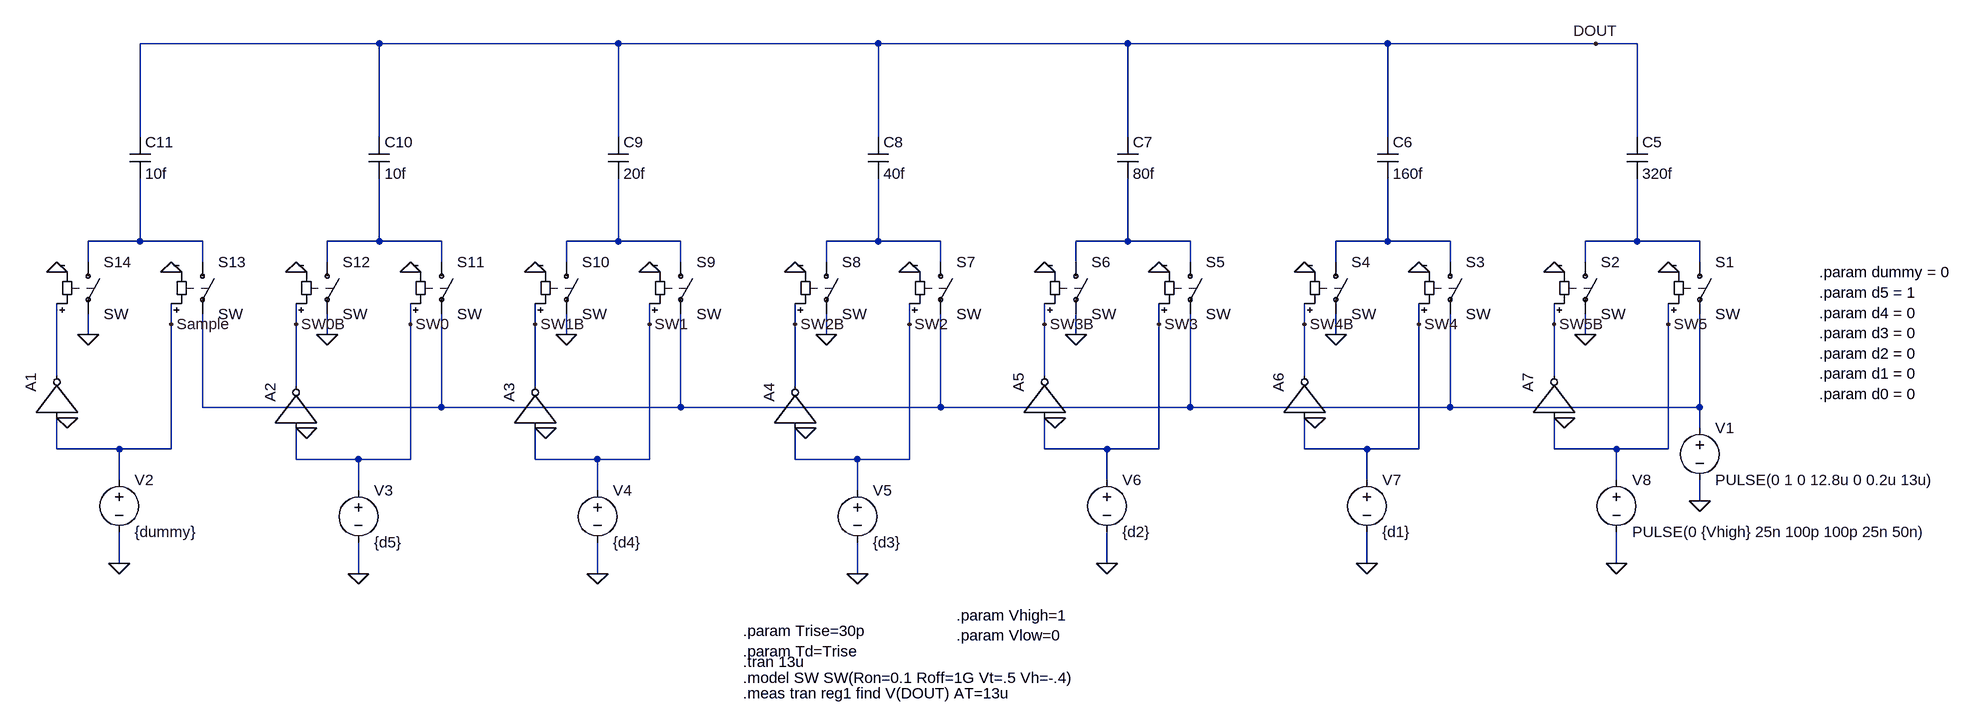
[diagram p0: schematic Draft8.asc]
Draft8.asc, the LTspice schematic file:
Version 4
SHEET 1 2616 1568
WIRE 240 384 -128 384
WIRE 608 384 240 384
WIRE 1008 384 608 384
WIRE 1392 384 1008 384
WIRE 1792 384 1392 384
WIRE 2112 384 1792 384
WIRE 2176 384 2112 384
WIRE -128 528 -128 384
WIRE 240 528 240 384
WIRE 608 528 608 384
WIRE 1008 528 1008 384
WIRE 1392 528 1392 384
WIRE 1792 528 1792 384
WIRE 2176 528 2176 384
WIRE -128 688 -128 592
WIRE -128 688 -208 688
WIRE -32 688 -128 688
WIRE 240 688 240 592
WIRE 240 688 160 688
WIRE 336 688 240 688
WIRE 608 688 608 592
WIRE 608 688 528 688
WIRE 704 688 608 688
WIRE 1008 688 1008 592
WIRE 1008 688 928 688
WIRE 1104 688 1008 688
WIRE 1392 688 1392 592
WIRE 1392 688 1312 688
WIRE 1488 688 1392 688
WIRE 1792 688 1792 592
WIRE 1792 688 1712 688
WIRE 1888 688 1792 688
WIRE 2176 688 2176 592
WIRE 2176 688 2096 688
WIRE 2272 688 2176 688
WIRE -208 720 -208 688
WIRE -32 720 -32 688
WIRE 160 720 160 688
WIRE 336 720 336 688
WIRE 528 720 528 688
WIRE 704 720 704 688
WIRE 928 720 928 688
WIRE 1104 720 1104 688
WIRE 1312 720 1312 688
WIRE 1488 720 1488 688
WIRE 1712 720 1712 688
WIRE 1888 720 1888 688
WIRE 2096 720 2096 688
WIRE 2272 720 2272 688
WIRE -80 816 -80 784
WIRE 112 816 112 784
WIRE 288 816 288 784
WIRE 480 816 480 784
WIRE 656 816 656 784
WIRE 880 816 880 784
WIRE 1056 816 1056 784
WIRE 1264 816 1264 784
WIRE 1440 816 1440 784
WIRE 1664 816 1664 784
WIRE 1840 816 1840 784
WIRE 2048 816 2048 784
WIRE 2224 816 2224 784
WIRE -208 832 -208 800
WIRE 160 832 160 800
WIRE 528 832 528 800
WIRE 928 832 928 800
WIRE 1312 832 1312 800
WIRE 1712 832 1712 800
WIRE 2096 832 2096 800
WIRE -256 896 -256 784
WIRE 1264 896 1264 816
WIRE 1664 896 1664 816
WIRE 2048 896 2048 816
WIRE 112 912 112 816
WIRE 480 912 480 816
WIRE 880 912 880 816
WIRE -32 944 -32 800
WIRE 336 944 336 800
WIRE 336 944 -32 944
WIRE 704 944 704 800
WIRE 704 944 336 944
WIRE 1104 944 1104 800
WIRE 1104 944 704 944
WIRE 1488 944 1488 800
WIRE 1488 944 1104 944
WIRE 1888 944 1888 800
WIRE 1888 944 1488 944
WIRE 2272 944 2272 800
WIRE 2272 944 1888 944
WIRE 2272 976 2272 944
WIRE -256 1008 -256 960
WIRE -160 1008 -256 1008
WIRE -80 1008 -80 816
WIRE -80 1008 -160 1008
WIRE 1264 1008 1264 960
WIRE 1360 1008 1264 1008
WIRE 1440 1008 1440 816
WIRE 1440 1008 1360 1008
WIRE 1664 1008 1664 960
WIRE 1760 1008 1664 1008
WIRE 1840 1008 1840 816
WIRE 1840 1008 1760 1008
WIRE 2048 1008 2048 960
WIRE 2144 1008 2048 1008
WIRE 2224 1008 2224 816
WIRE 2224 1008 2144 1008
WIRE 112 1024 112 976
WIRE 208 1024 112 1024
WIRE 288 1024 288 816
WIRE 288 1024 208 1024
WIRE 480 1024 480 976
WIRE 576 1024 480 1024
WIRE 656 1024 656 816
WIRE 656 1024 576 1024
WIRE 880 1024 880 976
WIRE 976 1024 880 1024
WIRE 1056 1024 1056 816
WIRE 1056 1024 976 1024
WIRE -160 1056 -160 1008
WIRE 1360 1056 1360 1008
WIRE 1760 1056 1760 1008
WIRE 2144 1056 2144 1008
WIRE 208 1072 208 1024
WIRE 576 1072 576 1024
WIRE 976 1072 976 1024
WIRE 2272 1088 2272 1056
WIRE -160 1184 -160 1136
WIRE 1360 1184 1360 1136
WIRE 1760 1184 1760 1136
WIRE 2144 1184 2144 1136
WIRE 208 1200 208 1152
WIRE 576 1200 576 1152
WIRE 976 1200 976 1152
FLAG 2096 832 0
FLAG 2224 736 0
FLAG 2048 736 0
FLAG 2224 816 SW5
FLAG 2048 816 SW5B
FLAG 1712 832 0
FLAG 1840 736 0
FLAG 1664 736 0
FLAG 1840 816 SW4
FLAG 1664 816 SW4B
FLAG 1312 832 0
FLAG 1440 736 0
FLAG 1264 736 0
FLAG 1440 816 SW3
FLAG 1264 816 SW3B
FLAG 928 832 0
FLAG 1056 736 0
FLAG 880 736 0
FLAG 1056 816 SW2
FLAG 880 816 SW2B
FLAG 528 832 0
FLAG 656 736 0
FLAG 480 736 0
FLAG 656 816 SW1
FLAG 480 816 SW1B
FLAG 160 832 0
FLAG 288 736 0
FLAG 112 736 0
FLAG 288 816 SW0
FLAG 112 816 SW0B
FLAG -208 832 0
FLAG -80 736 0
FLAG -256 736 0
FLAG -80 816 Sample
FLAG 2272 1088 0
FLAG -240 960 0
FLAG -160 1184 0
FLAG 128 976 0
FLAG 208 1200 0
FLAG 496 976 0
FLAG 576 1200 0
FLAG 896 976 0
FLAG 976 1200 0
FLAG 1280 960 0
FLAG 1360 1184 0
FLAG 1680 960 0
FLAG 1760 1184 0
FLAG 2064 960 0
FLAG 2144 1184 0
FLAG 2112 384 DOUT
SYMBOL cap 2160 528 R0
SYMATTR InstName C5
SYMATTR Value 320f
SYMBOL sw 2272 704 R0
SYMATTR InstName S1
SYMBOL sw 2096 704 R0
SYMATTR InstName S2
SYMBOL cap 1776 528 R0
SYMATTR InstName C6
SYMATTR Value 160f
SYMBOL sw 1888 704 R0
SYMATTR InstName S3
SYMBOL sw 1712 704 R0
SYMATTR InstName S4
SYMBOL cap 1376 528 R0
SYMATTR InstName C7
SYMATTR Value 80f
SYMBOL sw 1488 704 R0
SYMATTR InstName S5
SYMBOL sw 1312 704 R0
SYMATTR InstName S6
SYMBOL cap 992 528 R0
SYMATTR InstName C8
SYMATTR Value 40f
SYMBOL sw 1104 704 R0
SYMATTR InstName S7
SYMBOL sw 928 704 R0
SYMATTR InstName S8
SYMBOL cap 592 528 R0
SYMATTR InstName C9
SYMATTR Value 20f
SYMBOL sw 704 704 R0
SYMATTR InstName S9
SYMBOL sw 528 704 R0
SYMATTR InstName S10
SYMBOL cap 224 528 R0
SYMATTR InstName C10
SYMATTR Value 10f
SYMBOL sw 336 704 R0
SYMATTR InstName S11
SYMBOL sw 160 704 R0
SYMATTR InstName S12
SYMBOL cap -144 528 R0
SYMATTR InstName C11
SYMATTR Value 10f
SYMBOL sw -32 704 R0
SYMATTR InstName S13
SYMBOL sw -208 704 R0
SYMATTR InstName S14
SYMBOL voltage 2272 960 R0
WINDOW 123 0 0 Left 0
WINDOW 39 0 0 Left 0
SYMATTR InstName V1
SYMATTR Value PULSE(0 1 0 12.8u 0 0.2u 13u)
SYMBOL Digital\\inv -320 960 R270
SYMATTR InstName A1
SYMATTR SpiceLine Vhigh={Vhigh} Vlow={Vlow} Td={Td} Trise={Trise}
SYMBOL voltage -160 1040 R0
WINDOW 123 0 0 Left 0
WINDOW 39 0 0 Left 0
SYMATTR InstName V2
SYMATTR Value {dummy}
SYMBOL Digital\\inv 48 976 R270
SYMATTR InstName A2
SYMATTR SpiceLine Vhigh={Vhigh} Vlow={Vlow} Td={Td} Trise={Trise}
SYMBOL voltage 208 1056 R0
WINDOW 123 0 0 Left 0
WINDOW 39 0 0 Left 0
SYMATTR InstName V3
SYMATTR Value {d5}
SYMBOL Digital\\inv 416 976 R270
SYMATTR InstName A3
SYMATTR SpiceLine Vhigh={Vhigh} Vlow={Vlow} Td={Td} Trise={Trise}
SYMBOL voltage 576 1056 R0
WINDOW 123 0 0 Left 0
WINDOW 39 0 0 Left 0
SYMATTR InstName V4
SYMATTR Value {d4}
SYMBOL Digital\\inv 816 976 R270
SYMATTR InstName A4
SYMATTR SpiceLine Vhigh={Vhigh} Vlow={Vlow} Td={Td} Trise={Trise}
SYMBOL voltage 976 1056 R0
WINDOW 123 0 0 Left 0
WINDOW 39 0 0 Left 0
SYMATTR InstName V5
SYMATTR Value {d3}
SYMBOL Digital\\inv 1200 960 R270
SYMATTR InstName A5
SYMATTR SpiceLine Vhigh={Vhigh} Vlow={Vlow} Td={Td} Trise={Trise}
SYMBOL voltage 1360 1040 R0
WINDOW 123 0 0 Left 0
WINDOW 39 0 0 Left 0
SYMATTR InstName V6
SYMATTR Value {d2}
SYMBOL Digital\\inv 1600 960 R270
SYMATTR InstName A6
SYMATTR SpiceLine Vhigh={Vhigh} Vlow={Vlow} Td={Td} Trise={Trise}
SYMBOL voltage 1760 1040 R0
WINDOW 123 0 0 Left 0
WINDOW 39 0 0 Left 0
SYMATTR InstName V7
SYMATTR Value {d1}
SYMBOL Digital\\inv 1984 960 R270
SYMATTR InstName A7
SYMATTR SpiceLine Vhigh={Vhigh} Vlow={Vlow} Td={Td} Trise={Trise}
SYMBOL voltage 2144 1040 R0
WINDOW 123 0 0 Left 0
WINDOW 39 0 0 Left 0
SYMATTR InstName V8
SYMATTR Value PULSE(0 {Vhigh} 25n 100p 100p 25n 50n)
TEXT 800 1336 Left 2 !.tran 13u
TEXT 800 1360 Left 2 !.model SW SW(Ron=0.1 Roff=1G Vt=.5 Vh=-.4)
TEXT 800 1384 Left 2 !.meas tran reg1 find V(DOUT) AT=13u
TEXT 800 1288 Left 2 !.param Trise=30p\n.param Td=Trise
TEXT 1128 1264 Left 2 !.param Vhigh=1\n.param Vlow=0
TEXT 2456 736 Left 2 !.param dummy = 0\n.param d5 = 1\n.param d4 = 0\n.param d3 = 0\n.param d2 = 0\n.param d1 = 0\n.param d0 = 0

The netlist it stands for:
* Draft8.asc
C5 DOUT N007 320f
S1 N007 N009 SW5 0 SW
S2 N007 0 SW5B 0 SW
C6 DOUT N006 160f
S3 N006 N009 SW4 0 SW
S4 N006 0 SW4B 0 SW
C7 DOUT N005 80f
S5 N005 N009 SW3 0 SW
S6 N005 0 SW3B 0 SW
C8 DOUT N004 40f
S7 N004 N009 SW2 0 SW
S8 N004 0 SW2B 0 SW
C9 DOUT N003 20f
S9 N003 N009 SW1 0 SW
S10 N003 0 SW1B 0 SW
C10 DOUT N002 10f
S11 N002 N009 SW0 0 SW
S12 N002 0 SW0B 0 SW
C11 DOUT N001 10f
S13 N001 N009 Sample 0 SW
S14 N001 0 N008 0 SW
V1 N009 0 PULSE(0 1 0 12.8u 0 0.2u 13u)
A1 Sample 0 0 0 0 N008 0 0 BUF Vhigh={Vhigh} Vlow={Vlow} Td={Td} Trise={Trise}
V2 Sample 0 {dummy}
A2 SW0 0 0 0 0 SW0B 0 0 BUF Vhigh={Vhigh} Vlow={Vlow} Td={Td} Trise={Trise}
V3 SW0 0 {d5}
A3 SW1 0 0 0 0 SW1B 0 0 BUF Vhigh={Vhigh} Vlow={Vlow} Td={Td} Trise={Trise}
V4 SW1 0 {d4}
A4 SW2 0 0 0 0 SW2B 0 0 BUF Vhigh={Vhigh} Vlow={Vlow} Td={Td} Trise={Trise}
V5 SW2 0 {d3}
A5 SW3 0 0 0 0 SW3B 0 0 BUF Vhigh={Vhigh} Vlow={Vlow} Td={Td} Trise={Trise}
V6 SW3 0 {d2}
A6 SW4 0 0 0 0 SW4B 0 0 BUF Vhigh={Vhigh} Vlow={Vlow} Td={Td} Trise={Trise}
V7 SW4 0 {d1}
A7 SW5 0 0 0 0 SW5B 0 0 BUF Vhigh={Vhigh} Vlow={Vlow} Td={Td} Trise={Trise}
V8 SW5 0 PULSE(0 {Vhigh} 25n 100p 100p 25n 50n)
.tran 13u
.model SW SW(Ron=0.1 Roff=1G Vt=.5 Vh=-.4)
.meas tran reg1 find V(DOUT) AT=13u
.param Trise=30p
.param Td=Trise
.param Vhigh=1
.param Vlow=0
.param dummy = 0
.param d5 = 1
.param d4 = 0
.param d3 = 0
.param d2 = 0
.param d1 = 0
.param d0 = 0
.backanno
.end